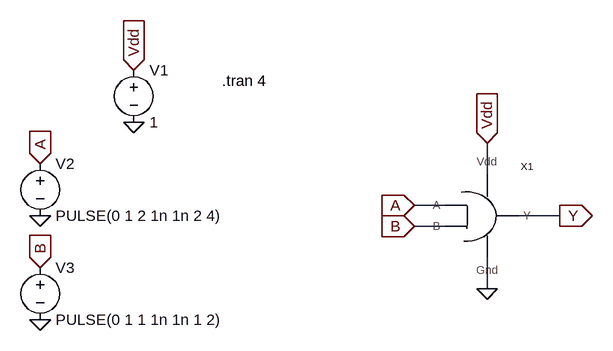
[diagram p0: schematic OR_Test.asc]
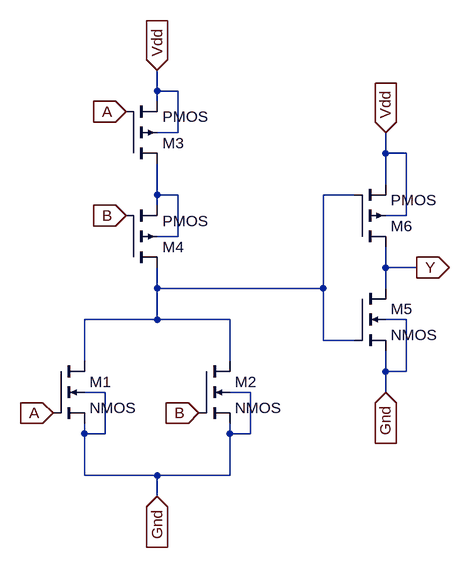
[diagram p1: sub-circuit or.asc]
OR_Test.asc, the LTspice schematic file:
Version 4
SHEET 1 880 680
WIRE 416 112 416 64
WIRE 352 160 304 160
WIRE 528 176 464 176
WIRE 352 192 304 192
WIRE 416 288 416 240
FLAG 304 160 A
IOPIN 304 160 In
FLAG 304 192 B
IOPIN 304 192 In
FLAG 416 64 Vdd
IOPIN 416 64 In
FLAG 528 176 Y
IOPIN 528 176 Out
FLAG 416 288 0
FLAG -128 -48 Vdd
IOPIN -128 -48 In
FLAG -128 32 0
FLAG -272 176 0
FLAG -272 336 0
FLAG -272 96 A
IOPIN -272 96 In
FLAG -272 256 B
IOPIN -272 256 In
SYMBOL OR 416 144 R0
SYMATTR InstName X1
SYMBOL voltage -128 -64 R0
WINDOW 123 0 0 Left 0
WINDOW 39 0 0 Left 0
SYMATTR InstName V1
SYMATTR Value 1
SYMBOL voltage -272 80 R0
WINDOW 123 0 0 Left 0
WINDOW 39 0 0 Left 0
SYMATTR InstName V2
SYMATTR Value PULSE(0 1 2 1n 1n 2 4)
SYMBOL voltage -272 240 R0
WINDOW 123 0 0 Left 0
WINDOW 39 0 0 Left 0
SYMATTR InstName V3
SYMATTR Value PULSE(0 1 1 1n 1n 1 2)
TEXT 8 -32 Left 2 !.tran 4

or.asc, the sub-circuit schematic file:
Version 4
SHEET 1 880 680
WIRE 272 -416 272 -448
WIRE 304 -416 272 -416
WIRE 272 -400 272 -416
WIRE 304 -352 304 -416
WIRE 304 -352 272 -352
WIRE 624 -320 624 -352
WIRE 656 -320 624 -320
WIRE 624 -272 624 -320
WIRE 272 -256 272 -304
WIRE 304 -256 272 -256
WIRE 576 -256 528 -256
WIRE 272 -240 272 -256
WIRE 656 -224 656 -320
WIRE 656 -224 624 -224
WIRE 304 -192 304 -256
WIRE 304 -192 272 -192
WIRE 624 -144 624 -176
WIRE 672 -144 624 -144
WIRE 272 -112 272 -144
WIRE 528 -112 528 -256
WIRE 528 -112 272 -112
WIRE 624 -112 624 -144
WIRE 272 -64 272 -112
WIRE 272 -64 160 -64
WIRE 384 -64 272 -64
WIRE 656 -64 624 -64
WIRE 528 -32 528 -112
WIRE 576 -32 528 -32
WIRE 160 0 160 -64
WIRE 384 0 384 -64
WIRE 624 16 624 -16
WIRE 656 16 656 -64
WIRE 656 16 624 16
WIRE 192 48 160 48
WIRE 416 48 384 48
WIRE 624 48 624 16
WIRE 160 112 160 96
WIRE 192 112 192 48
WIRE 192 112 160 112
WIRE 384 112 384 96
WIRE 416 112 416 48
WIRE 416 112 384 112
WIRE 160 176 160 112
WIRE 272 176 160 176
WIRE 384 176 384 112
WIRE 384 176 272 176
WIRE 272 208 272 176
FLAG 272 -448 Vdd
IOPIN 272 -448 In
FLAG 224 -384 A
IOPIN 224 -384 In
FLAG 112 80 A
IOPIN 112 80 In
FLAG 224 -224 B
IOPIN 224 -224 In
FLAG 336 80 B
IOPIN 336 80 In
FLAG 272 208 Gnd
IOPIN 272 208 In
FLAG 624 -352 Vdd
IOPIN 624 -352 In
FLAG 624 48 Gnd
IOPIN 624 48 In
FLAG 672 -144 Y
IOPIN 672 -144 Out
SYMBOL nmos4 112 0 R0
SYMATTR InstName M1
SYMBOL nmos4 336 0 R0
SYMATTR InstName M2
SYMBOL pmos4 224 -304 M180
SYMATTR InstName M3
SYMBOL pmos4 224 -144 M180
SYMATTR InstName M4
SYMBOL nmos4 576 -112 R0
SYMATTR InstName M5
SYMBOL pmos4 576 -176 M180
SYMATTR InstName M6

The netlist it stands for:
* OR_Test.asc
XX1 Vdd Y 0 A B or
V1 Vdd 0 1
V2 A 0 PULSE(0 1 2 1n 1n 2 4)
V3 B 0 PULSE(0 1 1 1n 1n 1 2)

* block symbol definitions
.subckt or Vdd Y Gnd A B
M1 N002 A Gnd Gnd NMOS
M2 N002 B Gnd Gnd NMOS
M3 N001 A Vdd Vdd PMOS
M4 N002 B N001 N001 PMOS
M5 Y N002 Gnd Gnd NMOS
M6 Y N002 Vdd Vdd PMOS
.ends or

.model NMOS NMOS
.model PMOS PMOS
.lib standard.mos
.tran 4
.backanno
.end

* Results of the author's LTspice run, read from the files saved beside the schematic
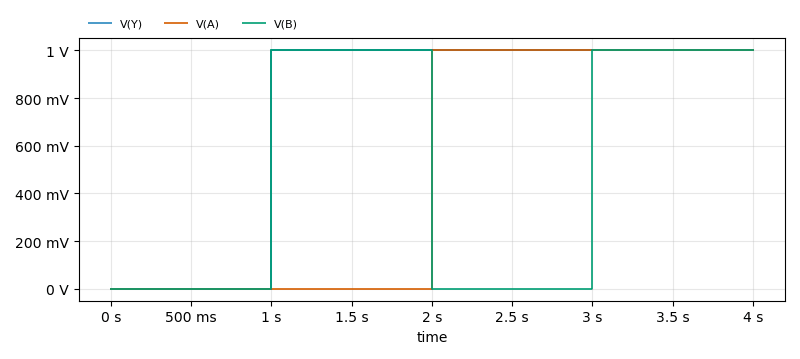
[diagram p2: Transient Analysis of OR_Test.asc, plotted from the saved traces]
* Transient Analysis, 1 run:
*   V(Y): min 100.5 nV, max 1 V, average 750 mV, rms 866 mV, last 1 V
*   V(A): min 0 V, max 1 V, average 500 mV, rms 707.1 mV, last 1 V
*   V(B): min 0 V, max 1 V, average 500 mV, rms 707.1 mV, last 1 V